# EAGLE design FTDI (EAGLE 7.2.0)
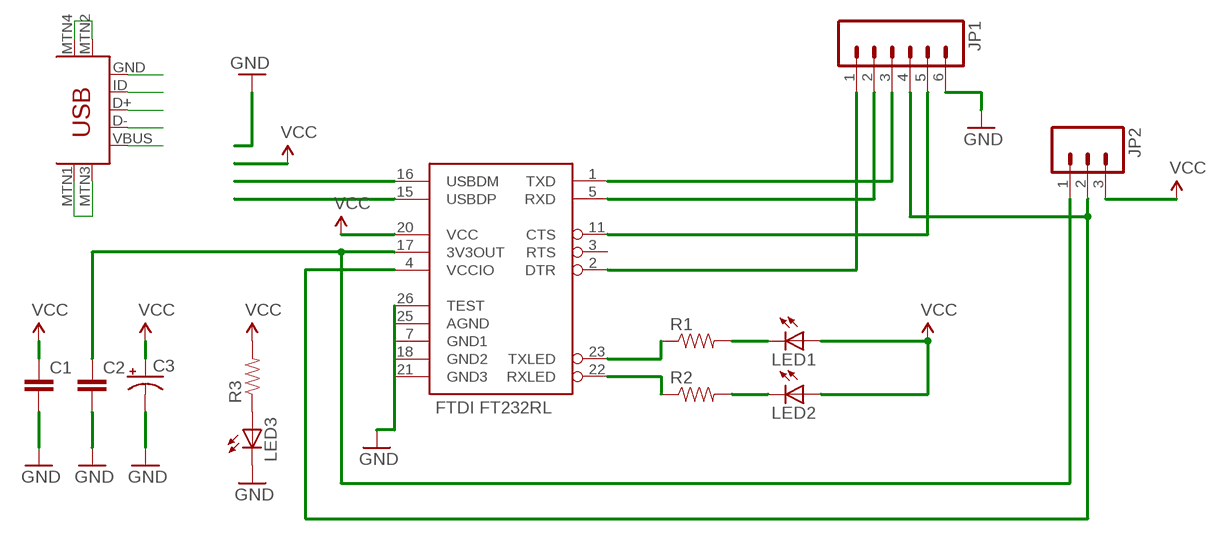
[diagram p0: schematic, sheet 1]

## Parts
C1  CAP0603-CAP  [0603-CAP]
C2  CAP0603-CAP  [0603-CAP]
C3  CAP_POL1206  [EIA3216]
JP1  M06SIP  [1X06]
JP2  M03PTH  [1X03]
LED1  LED0603  [LED-0603]
LED2  LED0603  [LED-0603]
LED3  LED0603  [LED-0603]
R1  RESISTOR0603-RES  [0603-RES]
R2  RESISTOR0603-RES  [0603-RES]
R3  RESISTOR0603-RES  [0603-RES]
U1  FT232RL-BASICSSOP  [SSOP28DB]
U$3  USB-MINIB-5PIN  [USB-MINIB]

## Nets
D+: U1.15(USBDP) U$3.D+
D-: U1.16(USBDM) U$3.D-
GND: C1.2 C2.2 C3.C(-) JP1.6 LED3.C U1.7(GND1) U1.18(GND2) U1.21(GND3) U1.25(AGND) U1.26(TEST) U$3.GND U$3.MTN1(MTN2) U$3.MTN2(MTN3) U$3.MTN3(MTN1) U$3.MTN4
N$2: R1.1 U1.23(TXLED)
N$3: LED1.C R1.2
N$4: LED2.C R2.2
N$5: R2.1 U1.22(RXLED)
N$7: JP1.1 U1.2(DTR)
N$8: JP1.2 U1.5(RXD)
N$9: JP1.3 U1.1(TXD)
N$10: JP1.5 U1.11(CTS)
N$11: JP1.4 JP2.2 U1.4(VCCIO)
N$12: C2.1 JP2.1 U1.17(3V3OUT)
N$13: LED3.A R3.1
N$15: U$3.ID
VCC: C1.1 C3.A(+) JP2.3 LED1.A LED2.A R3.2 U1.20(VCC) U$3.VBUS
Unconnected: U1.3(RTS)

## Notes on the sheet
- FTDI FT232RL

## Library data of the parts
C1 C2 = SparkFun:CAP: Capacitor Standard 0603 ceramic capacitor, and 0.1" leaded capacitor.
C3 = SparkFun:CAP_POL: Capacitor Polarized These are standard SMD and PTH capacitors. Normally 10uF, 47uF, and 100uF in electrolytic and tantalum varieties. Always verify the external diameter of the through hole cap, it varies with capacity, voltage, and manufacturer. The EIA devices should be standard.
JP1 = SparkFun:M06: Header 6 Standard 6-pin 0.1" header. Use with straight break away headers (SKU : PRT-00116), right angle break away headers (PRT-00553), swiss pins (PRT-00743), machine pins (PRT-00117), and female headers (PRT-00115). Molex polarized connector foot print use with SKU : PRT-08094 with associated crimp pins and housings. NOTES ON THE VARIANTS LOCK and LOCK_LONGPADS... This footprint was designed to help hold the alignment of a through-hole component (i.e. 6-pin header) while soldering it into place. You may notice that each hole has been shifted either up or down by 0.005 of an inch from it's more standard position (which is a perfectly straight line). This slight alteration caused the pins (the squares in the middle) to touch the edges of the holes. Because they are alternating, it causes a "brace" to hold the component in place. 0.005 has proven to be the perfect amount of "off-center" position when using our standard breakaway headers. Although looks a little odd when you look at the bare footprint, once you have a header in there, the alteration is very hard to notice. Also, if you push a header all the way into place, it is covered up entirely on the bottom side. This idea of altering the position of holes to aid alignment will be further integrated into the Sparkfun Library for other footprints. It can help hold any component with 3 or more connection pins.
JP2 = SparkFun:M03: Header 3 Standard 3-pin 0.1" header. Use with straight break away headers (SKU : PRT-00116), right angle break away headers (PRT-00553), swiss pins (PRT-00743), machine pins (PRT-00117), and female headers (PRT-00115). Molex polarized connector foot print use with SKU : PRT-08232 with associated crimp pins and housings.
LED1-LED3 = SparkFun:LED: LEDs Standard schematic elements and footprints for 5mm, 3mm, 1206, and 0603 sized LEDs. 5mm - Spark Fun Electronics SKU : COM-00529 (and others)
R1-R3 = SparkFun:RESISTOR: Resistor Basic schematic elements and footprints for 0603, 1206, and PTH resistors.
U1 = SparkFun:FT232RL-BASIC: USB UART This is the simplified version of the FT232RL unit. Only what you need, nothing you don't. Spark Fun Electronics SKU : COM-00650
U$3 = SparkFun-Connectors:USB-MINIB: Mini-USB "B" connector with 5th pin broken out. Created new symbol breaking out 5th "ID" pin in mini/micro USB connector spec. See: http://en.wikipedia.org/wiki/Mini_usb#Cables. Uses same footprint as 4-pin symbol. Also added pins to connect to mounting / shield pads if required (probably not generally needed as signals aren't shielded once they leave the connector).

## Board
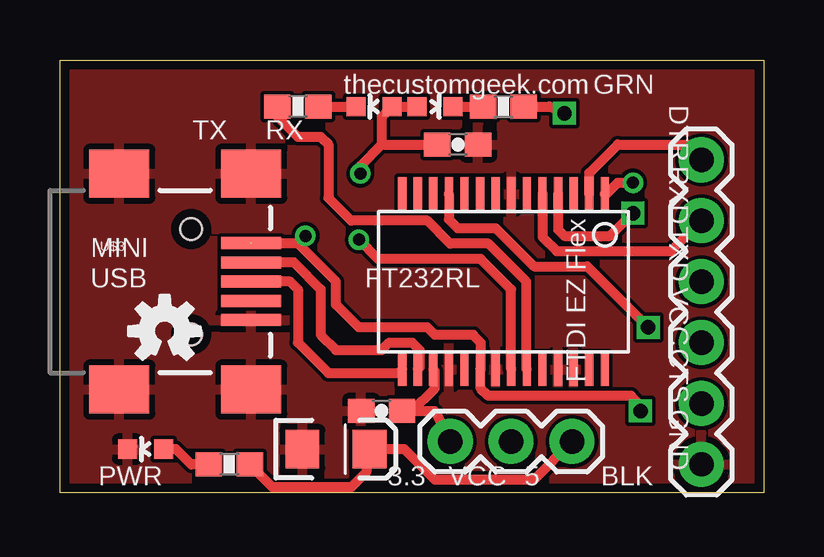
[diagram p1: board, top side]
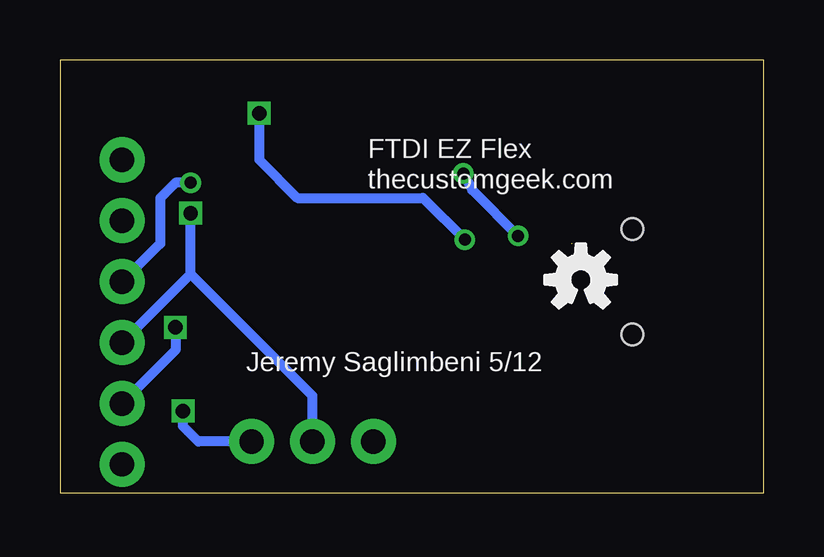
[diagram p2: board, bottom side, seen from below]

Size 29.34 x 18.06 mm. Coordinates in mm from the lower left corner, seen from the top.
Outline: 0,0 0,18.06 29.34,18.06 29.34,0 0,0
Copper layers (1*16): Top 0.0356mm / dielectric 1.5011mm / Bottom 0.0356mm
Design rules "default": minimum track width 6mil, minimum drill 13mil, track to track 6mil, track to pad 6mil, pad to pad 6mil, via to via 6mil, smd to smd 6mil, copper to edge 15mil, drill to drill 6mil, minimum pad ring 7mil, minimum via ring 7mil, stop-mask expansion 4mil, vias tented up to drill 0mil, thermal gap 10mil

### Footprints (pad centres in the part's own frame; a part is rotated, then mirrored left to right if it is on the bottom)
0603-CAP = smd 1.1 x 1: 1 -0.85,0; 2 0.85,0
EIA3216 = smd 1.4 x 1.6: A 1.4,0; C -1.4,0
1X06 = drill 1.016 pad 1.88: 1 0,0; 2 2.54,0; 3 5.08,0; 4 7.62,0; 5 10.16,0; 6 12.7,0
1X03 = drill 1.016 pad 1.88: 1 0,0; 2 2.54,0; 3 5.08,0
LED-0603 = smd 0.8 x 0.8: A 0,-0.75; C 0,0.75
0603-RES = smd 1.1 x 1: 1 -0.85,0; 2 0.85,0
SSOP28DB = smd 0.348 x 1.397: 1 -4.225,-3.656; 2 -3.575,-3.656; 3 -2.925,-3.656; 4 -2.275,-3.656; 5 -1.625,-3.656; 6 -0.975,-3.656; 7 -0.325,-3.656; 8 0.325,-3.656; 9 0.975,-3.656; 10 1.625,-3.656; 11 2.275,-3.656; 12 2.925,-3.656; 13 3.575,-3.656; 14 4.225,-3.656; 15 4.225,3.656; 16 3.575,3.656; 17 2.925,3.656; 18 2.275,3.656; 19 1.625,3.656; 20 0.975,3.656; 21 0.325,3.656; 22 -0.325,3.656; 23 -0.975,3.656; 24 -1.625,3.656; 25 -2.275,3.656; 26 -2.925,3.656; 27 -3.575,3.656; 28 -4.225,3.656
USB-MINIB = smd 2.5 x 0.5: D+ 2.5,0; D- 2.5,0.8; GND 2.5,-1.6; ID 2.5,-0.8; VBUS 2.5,1.6 | smd 2.5 x 2: MTN1 -3,4.5; MTN2 2.5,4.5; MTN3 -3,-4.5; MTN4 2.5,-4.5 | hole 0.9: 0,2.2; 0,-2.2

### Placement (x,y rotation side)
C1  16.59,14.53 0 top
C2  13.41,3.42 180 top
C3  11.51,1.83 0 top
JP1  26.75,13.89 270 top
JP2  16.27,2.15 0 top
LED1  13.09,16.12 90 top
LED2  15.63,16.12 270 top
LED3  3.57,1.83 90 top
R1  9.92,16.12 0 top
R2  18.49,16.12 180 top
R3  7.06,1.19 0 top
U1  18.49,8.81 180 top
U$1  [OSHW-LOGO-S]  4.36,6.75 0 top
U$2  [OSHW-LOGO-S]  7.62,8.89 0 bottom
U$3  5.47,8.81 0 top

### Tracks (layer width: path | path; a pad name or v marks a point on that pad's centre or on a via)
D+
  Top 0.406: U1.15 14.11,5 11.19,5 9.92,6.27 9.92,8.5 9.6,8.81 U$3.D+
D-
  Top 0.406: U1.16 15,5.24 15,5.96 14.68,6.27 13.73,6.27 13.41,5.96 11.51,5.96 10.87,6.59 10.87,8.5 9.75,9.61 U$3.D-
GND
  pour Top: -4.45,15.88 -4.45,-2.22 33.34,-2.22 33.34,20.64 -4.45,20.64
N$2
  Top 0.406: U1.23 19.44,5.18 19.44,8.81 17.86,10.4 16.27,10.4 15.32,11.35 12.14,11.35 11.19,12.31 11.19,14.53 10.87,14.85 9.92,14.85 9.07,15.7 R1.1
N$3
  Top 0.406: R1.2 LED1.C
N$4
  Top 0.406: LED2.C R2.2
N$5  (via drill 0.5, 0.6)
  Top 0.406: U1.22 18.81,8.5 17.54,9.77 13.25,9.77 v12.46,10.56 | R2.1 20.4,16.12 21.03,15.86 v21.03,15.84
  Bottom 0.406: v21.03,15.84 21.03,13.89 19.44,12.31 14.21,12.31 v12.46,10.56
N$7
  Top 0.406: U1.2 22.07,13.34 23.25,14.53 26.43,14.53 JP1.1
N$8
  Top 0.406: U1.5 20.12,10.68 20.71,10.08 25.48,10.08 JP1.2
N$9  (via drill 0.5)
  Top 0.406: U1.1 22.78,12.47 23.25,12.94 v23.89,12.94
  Bottom 0.406: v23.89,12.94 24.52,12.94 25.16,12.31 25.16,10.4 JP1.3
N$10  (via drill 0.6)
  Top 0.406: U1.11 16.22,11.41 16.59,11.04 18.17,11.04 19.76,9.45 21.98,9.45 v24.52,6.91
  Bottom 0.406: v24.52,6.91 24.52,5.96 JP1.5
N$11  (via drill 0.6)
  Top 0.406: U1.4 20.77,10.98 21.03,10.72 22.94,10.72 v23.89,11.67
  Bottom 0.406: JP1.4 23.89,9.13 | 23.89,9.13 v23.89,11.67 | JP2.2 18.81,4.05 23.89,9.13
N$12
  Top 0.406: 14.68,3.42 C2.1 14.05,3.42 | 14.68,3.42 15.63,4.37 15.63,5.09 U1.17 | 14.68,3.42 15.63,3.42 JP2.1
N$13
  Top 0.406: R3.1 5.47,1.19 4.84,1.83 LED3.A
VCC  (via drill 0.5, 0.6)  (1 unrouted)
  Top 0.254: 12.78,1.7 C3.A 13.41,1.83
  Top 0.406: 9.92,10.4 11.51,8.81 11.51,7.86 12.46,6.91 15.32,6.91 15.63,6.59 17.22,6.59 17.54,6.27 17.54,5.18 U1.20 17.54,5.13 17.54,4.37 17.86,4.05 23.81,4.05 24.21,3.66 v24.21,3.42 | 9.92,10.4 7.99,10.4 | 9.92,10.4 v10.24,10.72 | JP2.3 19.76,0.56 15.63,0.56 14.36,1.83 13.41,1.83 | v12.52,13.32 12.52,13.64 13.41,14.53 | 13.41,14.53 C1.1 | 12.78,1.7 12.78,0.88 12.14,0.24 8.86,0.24 R3.2 | LED2.A LED1.A 13.41,15.68 13.41,14.53
  Bottom 0.406: v12.52,13.32 12.14,12.62 v10.24,10.72 | JP2.3 23.57,2.15 24.21,2.78 v24.21,3.42

### Text on the board
tPlace: thecustomgeek.com | GRN | TX | RX | DTR | RXD | TXD | MINI | USB | FT232RL | VCC | CTS | FTDI EZ Flex | GND | PWR | 3.3 | VCC | 5 | BLK
bPlace: FTDI EZ Flex | thecustomgeek.com | Jeremy Saglimbeni 5/12